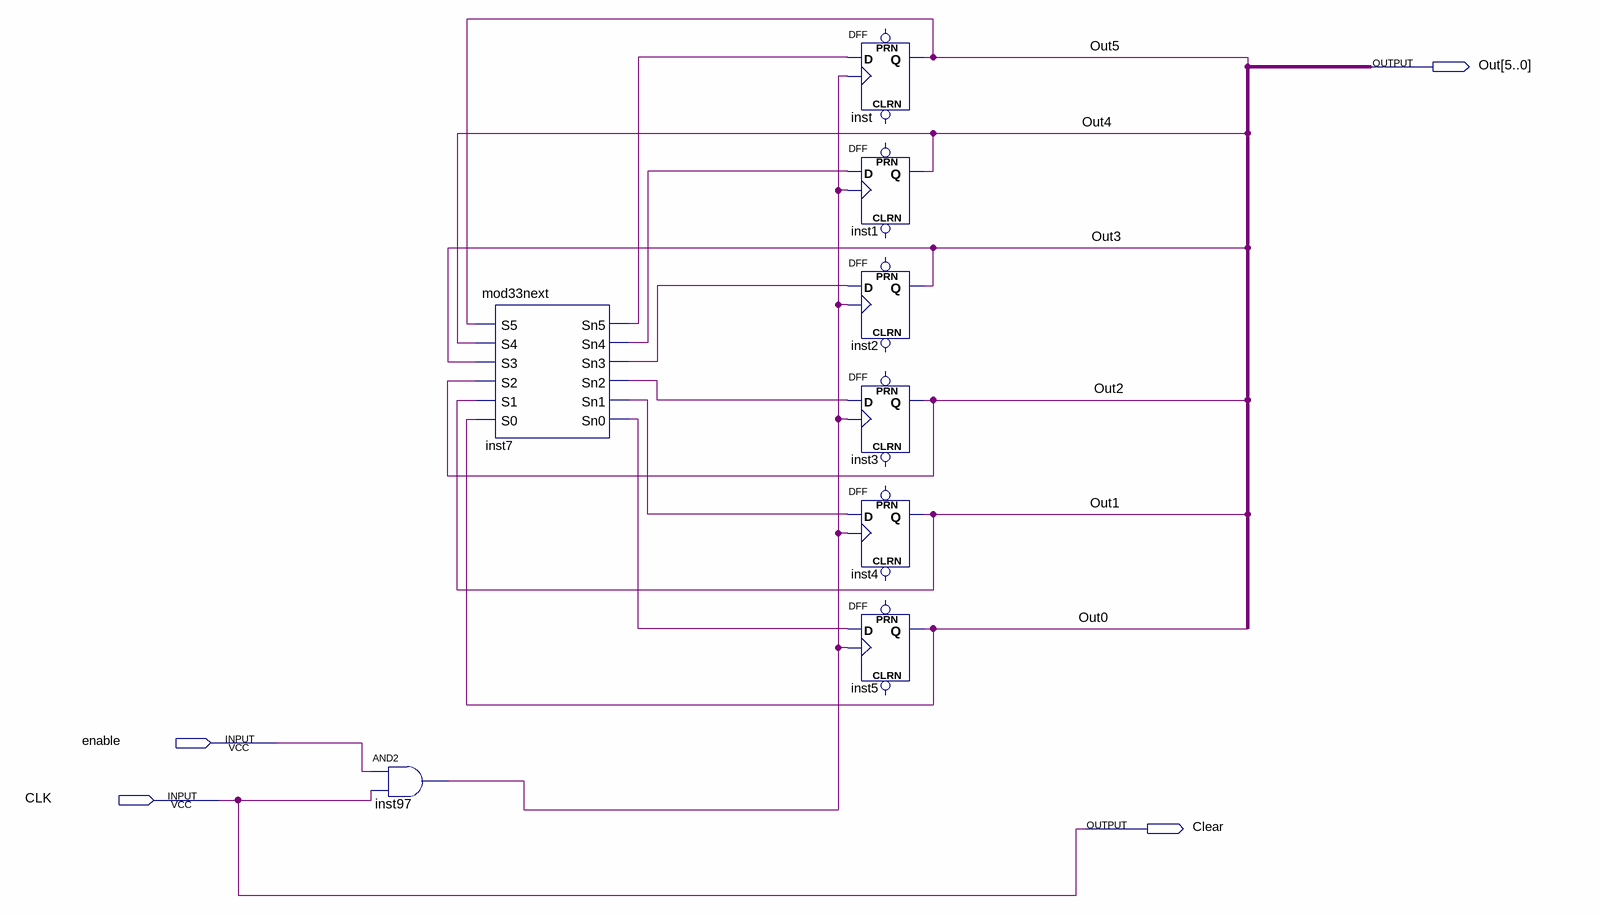
[diagram p0: schematic sheet]
// Quartus schematic mod33counter.bdf as structural Verilog: 8 symbols, 4 pins
module mod33counter (
  input  enable,
  input  CLK,
  output [5:0] Out,
  output Clear
);

  wire inst7_sn0, inst7_sn1, inst7_sn2, inst7_sn3, inst7_sn4, inst7_sn5, inst97_out;

  and inst97 (inst97_out, enable, CLK);
  mod33next inst7 (
    .S5(Out[5]), .S4(Out[4]), .S3(Out[3]), .S2(Out[2]), .S1(Out[1]), .S0(Out[0]), .Sn5(inst7_sn5),
    .Sn4(inst7_sn4), .Sn3(inst7_sn3), .Sn2(inst7_sn2), .Sn1(inst7_sn1), .Sn0(inst7_sn0));
  DFF inst (.CLK(inst97_out), .D(inst7_sn5), .Q(Out[5]));  // open: CLRN, PRN
  DFF inst1 (.CLK(inst97_out), .D(inst7_sn4), .Q(Out[4]));  // open: CLRN, PRN
  DFF inst2 (.CLK(inst97_out), .D(inst7_sn3), .Q(Out[3]));  // open: CLRN, PRN
  DFF inst3 (.CLK(inst97_out), .D(inst7_sn2), .Q(Out[2]));  // open: CLRN, PRN
  DFF inst4 (.CLK(inst97_out), .D(inst7_sn1), .Q(Out[1]));  // open: CLRN, PRN
  DFF inst5 (.CLK(inst97_out), .D(inst7_sn0), .Q(Out[0]));  // open: CLRN, PRN

  assign Clear = CLK;
endmodule
